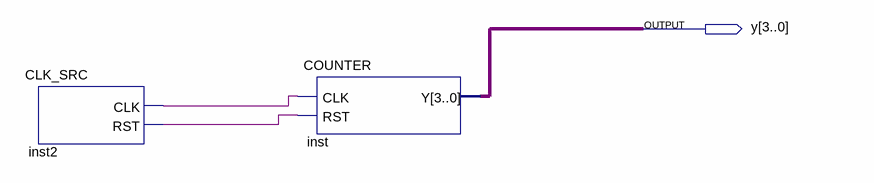
[diagram p0: schematic sheet]
// Quartus schematic tb_top.bdf as structural Verilog: 2 symbols, 1 pins
module tb_top (
  output [3:0] y
);

  wire inst2_clk, inst2_rst;

  CLK_SRC inst2 (.CLK(inst2_clk), .RST(inst2_rst));
  COUNTER inst (.CLK(inst2_clk), .RST(inst2_rst), .Y(y));
endmodule
